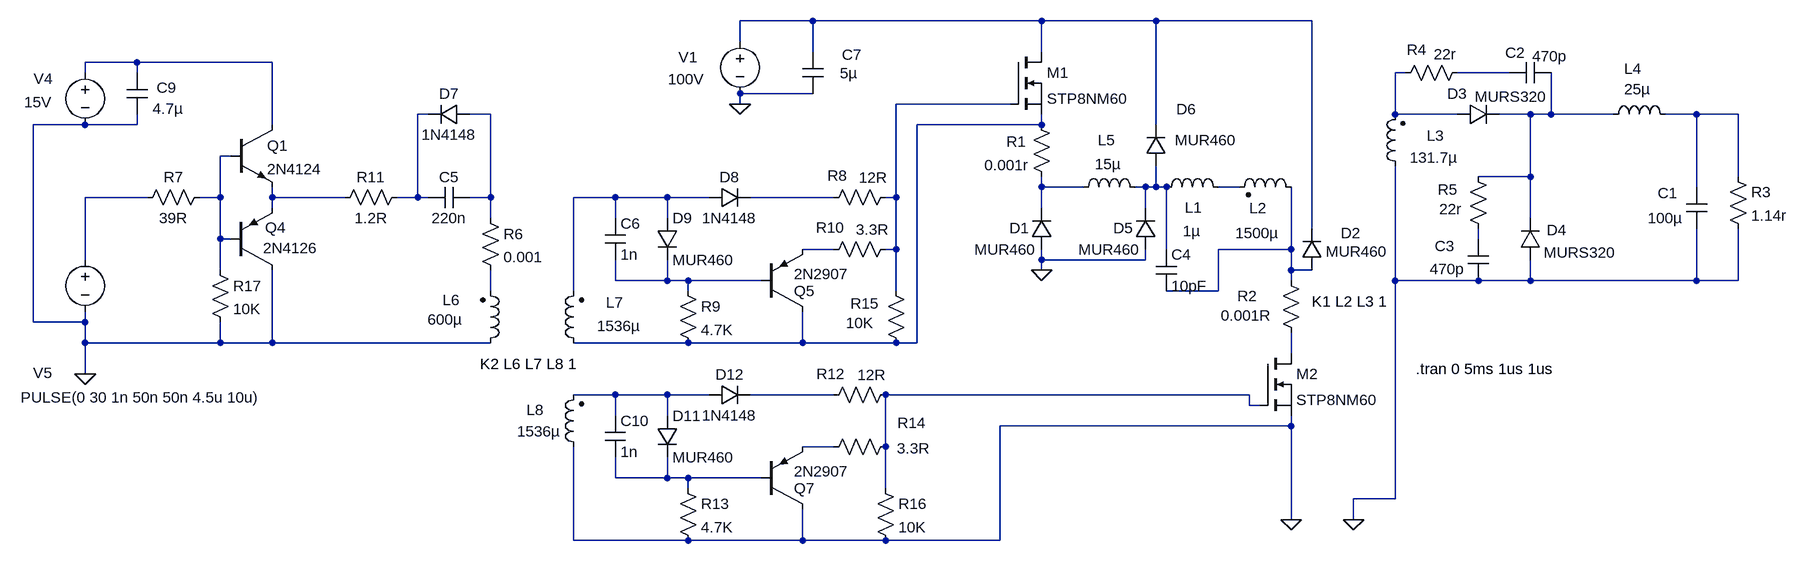
[diagram p0: schematic 驱动变压器+主回路仿真，下管VDS有个沟是变压器电容或者次级吸收电容大了.asc]
驱动变压器+主回路仿真，下管VDS有个沟是变压器电容或者次级吸收电容大了.asc, the LTspice schematic file:
Version 4
SHEET 1 4236 1156
WIRE 2400 64 2288 64
WIRE 2752 64 2400 64
WIRE 2928 64 2752 64
WIRE 3168 64 2928 64
WIRE 2288 96 2288 64
WIRE 2400 112 2400 64
WIRE 2752 112 2752 64
WIRE 1360 128 1280 128
WIRE 1568 128 1360 128
WIRE 1280 144 1280 128
WIRE 1360 144 1360 128
WIRE 3312 144 3296 144
WIRE 3472 144 3392 144
WIRE 2400 176 2288 176
WIRE 2288 192 2288 176
WIRE 2704 192 2528 192
WIRE 1808 208 1792 208
WIRE 1904 208 1872 208
WIRE 3296 208 3296 144
WIRE 3392 208 3296 208
WIRE 3504 208 3456 208
WIRE 3536 208 3536 144
WIRE 3536 208 3504 208
WIRE 3632 208 3536 208
WIRE 3760 208 3712 208
WIRE 3824 208 3760 208
WIRE 1280 224 1200 224
WIRE 1360 224 1360 208
WIRE 1360 224 1280 224
WIRE 1568 224 1568 128
WIRE 2752 224 2752 208
WIRE 2752 224 2560 224
WIRE 2928 224 2928 64
WIRE 1504 272 1488 272
WIRE 3504 304 3504 208
WIRE 3504 304 3424 304
WIRE 3824 304 3824 208
WIRE 2752 320 2752 304
WIRE 2816 320 2752 320
WIRE 2912 320 2896 320
WIRE 2928 320 2928 288
WIRE 2928 320 2912 320
WIRE 2944 320 2928 320
WIRE 3056 320 3024 320
WIRE 3760 320 3760 208
WIRE 1376 336 1280 336
WIRE 1488 336 1488 272
WIRE 1488 336 1456 336
WIRE 1568 336 1568 320
WIRE 1680 336 1568 336
WIRE 1792 336 1792 208
WIRE 1792 336 1760 336
WIRE 1808 336 1792 336
WIRE 1904 336 1904 208
WIRE 1904 336 1872 336
WIRE 2096 336 2032 336
WIRE 2176 336 2096 336
WIRE 2240 336 2176 336
WIRE 2432 336 2304 336
WIRE 2528 336 2528 192
WIRE 2528 336 2512 336
WIRE 1568 352 1568 336
WIRE 2752 352 2752 320
WIRE 2912 352 2912 320
WIRE 1904 368 1904 336
WIRE 2096 368 2096 336
WIRE 2176 368 2176 336
WIRE 3504 368 3504 304
WIRE 3168 384 3168 64
WIRE 1488 400 1488 336
WIRE 1504 400 1488 400
WIRE 3424 400 3424 384
WIRE 2432 416 2384 416
WIRE 2528 416 2528 336
WIRE 2528 416 2512 416
WIRE 2944 416 2944 320
WIRE 3136 416 3136 320
WIRE 3136 416 3024 416
WIRE 1280 432 1280 336
WIRE 2752 432 2752 416
WIRE 2912 432 2912 416
WIRE 2912 432 2752 432
WIRE 1488 448 1488 400
WIRE 2752 448 2752 432
WIRE 3136 448 3136 416
WIRE 3168 448 3136 448
WIRE 2096 464 2096 432
WIRE 2176 464 2176 432
WIRE 2176 464 2096 464
WIRE 2208 464 2176 464
WIRE 2320 464 2208 464
WIRE 3136 464 3136 448
WIRE 3296 464 3296 288
WIRE 3424 464 3296 464
WIRE 3504 464 3504 432
WIRE 3504 464 3424 464
WIRE 3760 464 3760 384
WIRE 3760 464 3504 464
WIRE 3824 464 3824 384
WIRE 3824 464 3760 464
WIRE 1904 480 1904 448
WIRE 2032 480 2032 336
WIRE 2208 480 2208 464
WIRE 2528 480 2528 416
WIRE 3024 480 3024 416
WIRE 3024 480 2944 480
WIRE 1200 528 1200 224
WIRE 1280 528 1280 512
WIRE 1280 528 1200 528
WIRE 1280 560 1280 528
WIRE 1488 560 1488 528
WIRE 1488 560 1280 560
WIRE 1568 560 1568 448
WIRE 1568 560 1488 560
WIRE 1904 560 1568 560
WIRE 2208 560 2032 560
WIRE 2384 560 2384 512
WIRE 2384 560 2208 560
WIRE 2528 560 2384 560
WIRE 2560 560 2560 224
WIRE 2560 560 2528 560
WIRE 3136 576 3136 544
WIRE 1280 608 1280 560
WIRE 2096 640 2032 640
WIRE 2176 640 2096 640
WIRE 2240 640 2176 640
WIRE 2432 640 2304 640
WIRE 3072 640 2512 640
WIRE 3072 656 3072 640
WIRE 3088 656 3072 656
WIRE 2096 672 2096 640
WIRE 2176 672 2176 640
WIRE 3136 688 3136 672
WIRE 3136 688 2688 688
WIRE 2432 720 2384 720
WIRE 2512 720 2512 640
WIRE 2096 768 2096 736
WIRE 2176 768 2176 736
WIRE 2176 768 2096 768
WIRE 2208 768 2176 768
WIRE 2320 768 2208 768
WIRE 2208 784 2208 768
WIRE 2512 784 2512 720
WIRE 3296 800 3296 464
WIRE 3296 800 3232 800
WIRE 3136 832 3136 688
WIRE 3232 832 3232 800
WIRE 2032 864 2032 720
WIRE 2208 864 2032 864
WIRE 2384 864 2384 816
WIRE 2384 864 2208 864
WIRE 2512 864 2384 864
WIRE 2688 864 2688 688
WIRE 2688 864 2512 864
FLAG 2288 192 0
FLAG 2752 448 0
FLAG 1280 608 0
FLAG 3232 832 0
FLAG 3136 832 0
SYMBOL ind 2800 336 R270
WINDOW 0 73 52 VTop 2
WINDOW 3 67 54 VBottom 2
SYMATTR InstName L5
SYMATTR Value 15µ
SYMBOL ind 2928 336 R270
WINDOW 0 -31 58 VTop 2
WINDOW 3 -36 55 VBottom 2
SYMATTR InstName L1
SYMATTR Value 1µ
SYMBOL ind2 3312 304 R180
WINDOW 0 -60 63 Left 2
WINDOW 3 -81 29 Left 2
SYMATTR InstName L3
SYMATTR Value 131.7µ
SYMATTR Type ind
SYMBOL voltage 2288 80 R0
WINDOW 0 -95 40 Left 2
WINDOW 123 0 0 Left 2
WINDOW 39 0 0 Left 2
WINDOW 3 -111 74 Left 2
SYMATTR InstName V1
SYMATTR Value 100V
SYMBOL nmos 2704 112 R0
SYMATTR InstName M1
SYMATTR Value STP8NM60
SYMBOL nmos 3088 576 R0
SYMATTR InstName M2
SYMATTR Value STP8NM60
SYMBOL ind 3616 224 R270
WINDOW 0 71 46 VTop 2
WINDOW 3 70 53 VBottom 2
SYMATTR InstName L4
SYMATTR Value 25µ
SYMBOL diode 2768 416 R180
WINDOW 0 35 33 Left 2
WINDOW 3 24 0 Left 2
SYMATTR InstName D1
SYMATTR Value MUR460
SYMBOL diode 2928 416 R180
WINDOW 0 35 33 Left 2
WINDOW 3 24 0 Left 2
SYMATTR InstName D5
SYMATTR Value MUR460
SYMBOL diode 2944 288 R180
WINDOW 0 -46 88 Left 2
WINDOW 3 -108 40 Left 2
SYMATTR InstName D6
SYMATTR Value MUR460
SYMBOL diode 3184 448 R180
WINDOW 0 -59 57 Left 2
WINDOW 3 -101 29 Left 2
SYMATTR InstName D2
SYMATTR Value MUR460
SYMBOL diode 3392 224 R270
WINDOW 0 32 0 VTop 2
WINDOW 3 59 82 VBottom 2
SYMATTR InstName D3
SYMATTR Value MURS320
SYMBOL res 2736 208 R0
WINDOW 0 -38 42 Left 2
WINDOW 3 -72 78 Left 2
SYMATTR InstName R1
SYMATTR Value 0.001r
SYMBOL res 3120 448 R0
WINDOW 0 -67 40 Left 2
WINDOW 3 -92 70 Left 2
SYMATTR InstName R2
SYMATTR Value 0.001R
SYMBOL res 3808 288 R0
SYMATTR InstName R3
SYMATTR Value 1.14r
SYMBOL res 3296 160 R270
WINDOW 0 36 33 VTop 2
WINDOW 3 60 77 VBottom 2
SYMATTR InstName R4
SYMATTR Value 22r
SYMBOL cap 3408 400 R0
WINDOW 0 -51 11 Left 2
WINDOW 3 -59 46 Left 2
SYMATTR InstName C3
SYMATTR Value 470p
SYMBOL cap 3536 128 R90
WINDOW 0 1 55 VBottom 2
WINDOW 3 -25 2 VTop 2
SYMATTR InstName C2
SYMATTR Value 470p
SYMBOL cap 3744 320 R0
WINDOW 0 -44 9 Left 2
WINDOW 3 -59 48 Left 2
SYMATTR InstName C1
SYMATTR Value 100µ
SYMBOL diode 3520 432 R180
WINDOW 0 -40 46 Left 2
WINDOW 3 -116 11 Left 2
SYMATTR InstName D4
SYMATTR Value MURS320
SYMBOL res 3408 288 R0
WINDOW 0 -46 36 Left 2
WINDOW 3 -44 66 Left 2
SYMATTR InstName R5
SYMATTR Value 22r
SYMBOL ind2 3152 336 M270
WINDOW 0 -32 67 VTop 2
WINDOW 3 -39 68 VBottom 2
SYMATTR InstName L2
SYMATTR Value 1500µ
SYMATTR Type ind
SYMBOL res 1888 352 R0
SYMATTR InstName R6
SYMATTR Value 0.001
SYMBOL res 1360 352 R270
WINDOW 0 32 56 VTop 2
WINDOW 3 0 56 VBottom 2
SYMATTR InstName R7
SYMATTR Value 39R
SYMBOL res 2416 352 R270
WINDOW 0 34 22 VTop 2
WINDOW 3 62 77 VBottom 2
SYMATTR InstName R8
SYMATTR Value 12R
SYMBOL res 2192 464 R0
SYMATTR InstName R9
SYMATTR Value 4.7K
SYMBOL res 2528 400 R90
WINDOW 0 -2 101 VBottom 2
WINDOW 3 -30 36 VTop 2
SYMATTR InstName R10
SYMATTR Value 3.3R
SYMBOL diode 1872 224 M270
WINDOW 0 32 32 VTop 2
WINDOW 3 0 32 VBottom 2
SYMATTR InstName D7
SYMATTR Value 1N4148
SYMBOL diode 2240 352 R270
WINDOW 0 32 32 VTop 2
WINDOW 3 0 32 VBottom 2
SYMATTR InstName D8
SYMATTR Value 1N4148
SYMBOL diode 2160 368 R0
SYMATTR InstName D9
SYMATTR Value MUR460
SYMBOL npn 1504 224 R0
SYMATTR InstName Q1
SYMATTR Value 2N4124
SYMBOL pnp 1504 448 M180
WINDOW 0 53 66 Left 2
WINDOW 3 50 34 Left 2
SYMATTR InstName Q4
SYMATTR Value 2N4126
SYMBOL pnp 2320 512 M180
WINDOW 0 51 32 Left 2
WINDOW 3 51 58 Left 2
SYMATTR InstName Q5
SYMATTR Value 2N2907
SYMBOL cap 1872 320 R90
WINDOW 0 0 32 VBottom 2
WINDOW 3 32 32 VTop 2
SYMATTR InstName C5
SYMATTR Value 220n
SYMBOL cap 2080 368 R0
SYMATTR InstName C6
SYMATTR Value 1n
SYMBOL voltage 1280 128 R0
WINDOW 0 -79 25 Left 2
WINDOW 3 -94 61 Left 2
SYMATTR InstName V4
SYMATTR Value 15V
SYMBOL voltage 1280 416 R0
WINDOW 0 -80 190 Left 2
WINDOW 3 -99 228 Left 2
WINDOW 123 0 0 Left 2
WINDOW 39 0 0 Left 2
SYMATTR InstName V5
SYMATTR Value PULSE(0 30 1n 50n 50n 4.5u 10u)
SYMBOL ind2 1888 576 M180
WINDOW 0 -58 82 Left 2
WINDOW 3 -81 52 Left 2
SYMATTR InstName L6
SYMATTR Value 600µ
SYMATTR Type ind
SYMBOL ind2 2048 576 R180
WINDOW 0 -61 78 Left 2
WINDOW 3 -87 42 Left 2
SYMATTR InstName L7
SYMATTR Value 1536µ
SYMATTR Type ind
SYMBOL res 1776 320 R90
WINDOW 0 0 56 VBottom 2
WINDOW 3 32 56 VTop 2
SYMATTR InstName R11
SYMATTR Value 1.2R
SYMBOL cap 1344 144 R0
WINDOW 0 46 23 Left 2
WINDOW 3 40 55 Left 2
SYMATTR InstName C9
SYMATTR Value 4.7µ
SYMATTR SpiceLine V=50V
SYMBOL ind2 2048 736 R180
WINDOW 0 62 73 Left 2
WINDOW 3 36 40 Left 2
SYMATTR InstName L8
SYMATTR Value 1536µ
SYMATTR Type ind
SYMBOL cap 2080 672 R0
SYMATTR InstName C10
SYMATTR Value 1n
SYMBOL diode 2160 672 R0
SYMATTR InstName D11
SYMATTR Value MUR460
SYMBOL diode 2240 656 R270
WINDOW 0 32 32 VTop 2
WINDOW 3 0 32 VBottom 2
SYMATTR InstName D12
SYMATTR Value 1N4148
SYMBOL res 2416 656 R270
WINDOW 0 33 12 VTop 2
WINDOW 3 62 75 VBottom 2
SYMATTR InstName R12
SYMATTR Value 12R
SYMBOL pnp 2320 816 M180
WINDOW 0 51 32 Left 2
WINDOW 3 51 58 Left 2
SYMATTR InstName Q7
SYMATTR Value 2N2907
SYMBOL res 2192 768 R0
SYMATTR InstName R13
SYMATTR Value 4.7K
SYMBOL res 2528 704 R90
WINDOW 0 -5 -24 VBottom 2
WINDOW 3 3 -27 VTop 2
SYMATTR InstName R14
SYMATTR Value 3.3R
SYMBOL res 2512 464 R0
WINDOW 0 -54 35 Left 2
WINDOW 3 -61 65 Left 2
SYMATTR InstName R15
SYMATTR Value 10K
SYMBOL res 2496 768 R0
SYMATTR InstName R16
SYMATTR Value 10K
SYMBOL res 1472 432 R0
SYMATTR InstName R17
SYMATTR Value 10K
SYMBOL cap 2384 112 R0
WINDOW 0 61 4 Left 2
WINDOW 3 58 33 Left 2
SYMATTR InstName C7
SYMATTR Value 5µ
SYMATTR SpiceLine V=500V
SYMBOL cap 2928 416 R0
SYMATTR InstName C4
SYMATTR Value 10pF
TEXT 3168 496 Left 2 !K1 L2 L3 1
TEXT 3328 600 Left 2 !.tran 0 5ms 1us 1us
TEXT 1888 592 Left 2 !K2 L6 L7 L8 1

The netlist it stands for:
* 驱动变压器+主回路仿真，下管VDS有个沟是变压器电容或者次级吸收电容大了.asc
L5 N012 N013 15µ
L1 N013 N014 1µ
L3 0 N003 131.7µ
V1 N001 0 100V
M1 N001 N005 N010 N010 STP8NM60
M2 N024 N027 0 0 STP8NM60
L4 N008 N009 25µ
D1 0 N012 MUR460
D5 0 N013 MUR460
D6 N013 N001 MUR460
D2 N021 N001 MUR460
D3 N003 N008 MURS320
R1 N010 N012 0.001r
R2 N021 N024 0.001R
R3 N009 0 1.14r
R4 N003 N004 22r
C3 N019 0 470p
C2 N008 N004 470p
C1 N009 0 100µ
D4 0 N008 MURS320
R5 N008 N019 22r
L2 N021 N014 1500µ
R6 N007 N023 0.001
R7 N015 N011 39R
R8 N018 N005 12R
R9 N022 N010 4.7K
R10 N005 N020 3.3R
D7 N007 N006 1N4148
D8 N017 N018 1N4148
D9 N017 N022 MUR460
Q1 N002 N011 N016 0 2N4124
Q4 0 N011 N016 0 2N4126
Q5 N010 N022 N020 0 2N2907
C5 N007 N006 220n
C6 N017 N022 1n
V4 N002 0 15V
V5 N015 0 PULSE(0 30 1n 50n 50n 4.5u 10u)
L6 0 N023 600µ
L7 N010 N017 1536µ
R11 N006 N016 1.2R
C9 N002 0 4.7µ V=50V
L8 0 N025 1536µ
C10 N025 N029 1n
D11 N025 N029 MUR460
D12 N025 N026 1N4148
R12 N026 N027 12R
Q7 0 N029 N028 0 2N2907
R13 N029 0 4.7K
R14 N027 N028 3.3R
R15 N005 N010 10K
R16 N027 0 10K
R17 N011 0 10K
C7 N001 0 5µ V=500V
C4 N013 N021 10pF
.model D D
.lib standard.dio
.model NPN NPN
.model PNP PNP
.lib standard.bjt
.model NMOS NMOS
.model PMOS PMOS
.lib standard.mos
K1 L2 L3 1
.tran 0 5ms 1us 1us
K2 L6 L7 L8 1
.backanno
.end